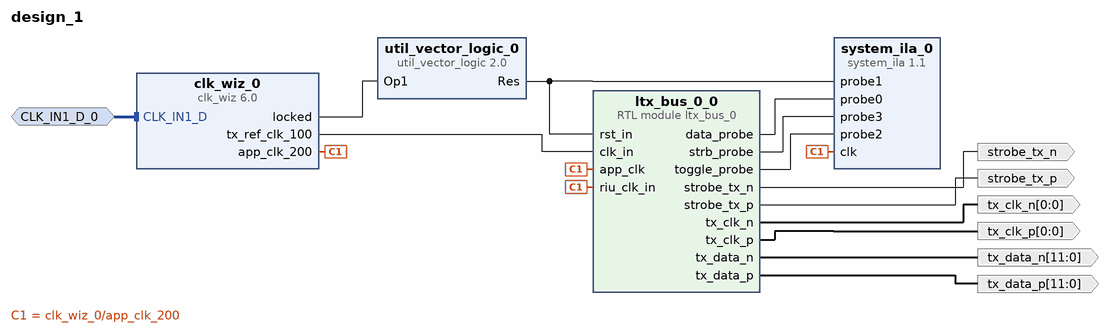
[diagram p0: block diagram of the top level]
# Vivado block design design_1, xcku060-ffva1517-2-e, Vivado 2025.1
create_bd_design design_1

create_bd_intf_port -mode Slave -vlnv xilinx.com:interface:diff_clock_rtl:1.0 CLK_IN1_D_0
set_property -dict {CONFIG.FREQ_HZ 400000000} [get_bd_intf_ports CLK_IN1_D_0]
create_bd_port -dir O -from 0 -to 0 -type clk tx_clk_p
create_bd_port -dir O -from 0 -to 0 -type clk tx_clk_n
create_bd_port -dir O -from 11 -to 0 tx_data_n
create_bd_port -dir O strobe_tx_p
create_bd_port -dir O strobe_tx_n
create_bd_port -dir O -from 11 -to 0 tx_data_p

create_bd_cell -type module -reference ltx_bus_0 ltx_bus_0_0
create_bd_cell -type ip -vlnv xilinx.com:ip:clk_wiz:6.0 clk_wiz_0
set_property -dict [list \
  CONFIG.CLKIN1_JITTER_PS 25.0 \
  CONFIG.CLKOUT1_DRIVES Buffer \
  CONFIG.CLKOUT1_JITTER 100.120 \
  CONFIG.CLKOUT1_PHASE_ERROR 79.885 \
  CONFIG.CLKOUT2_DRIVES Buffer \
  CONFIG.CLKOUT2_JITTER 87.254 \
  CONFIG.CLKOUT2_PHASE_ERROR 79.885 \
  CONFIG.CLKOUT2_REQUESTED_OUT_FREQ 200.000 \
  CONFIG.CLKOUT2_USED true \
  CONFIG.CLKOUT3_DRIVES Buffer \
  CONFIG.CLKOUT4_DRIVES Buffer \
  CONFIG.CLKOUT5_DRIVES Buffer \
  CONFIG.CLKOUT6_DRIVES Buffer \
  CONFIG.CLKOUT7_DRIVES Buffer \
  CONFIG.CLK_OUT1_PORT tx_ref_clk_100 \
  CONFIG.CLK_OUT2_PORT app_clk_200 \
  CONFIG.FEEDBACK_SOURCE FDBK_AUTO \
  CONFIG.MMCM_BANDWIDTH OPTIMIZED \
  CONFIG.MMCM_CLKFBOUT_MULT_F 2.500 \
  CONFIG.MMCM_CLKIN1_PERIOD 2.500 \
  CONFIG.MMCM_CLKIN2_PERIOD 10.0 \
  CONFIG.MMCM_CLKOUT0_DIVIDE_F 10.000 \
  CONFIG.MMCM_CLKOUT1_DIVIDE 5 \
  CONFIG.MMCM_COMPENSATION AUTO \
  CONFIG.NUM_OUT_CLKS 2 \
  CONFIG.OPTIMIZE_CLOCKING_STRUCTURE_EN true \
  CONFIG.PRIMITIVE MMCM \
  CONFIG.PRIM_IN_FREQ 400 \
  CONFIG.PRIM_SOURCE Differential_clock_capable_pin \
] [get_bd_cells clk_wiz_0]
create_bd_cell -type ip -vlnv xilinx.com:ip:util_vector_logic:2.0 util_vector_logic_0
set_property -dict {CONFIG.C_OPERATION not CONFIG.C_SIZE 1} [get_bd_cells util_vector_logic_0]
create_bd_cell -type ip -vlnv xilinx.com:ip:system_ila:1.1 system_ila_0
set_property -dict {CONFIG.C_MON_TYPE NATIVE CONFIG.C_NUM_OF_PROBES 4} [get_bd_cells system_ila_0]

# ---- connections ----

connect_bd_intf_net -intf_net CLK_IN1_D_0_1 [get_bd_intf_ports CLK_IN1_D_0] [get_bd_intf_pins clk_wiz_0/CLK_IN1_D]
connect_bd_net [get_bd_pins clk_wiz_0/app_clk_200] \
  [get_bd_pins system_ila_0/clk] [get_bd_pins ltx_bus_0_0/riu_clk_in] [get_bd_pins ltx_bus_0_0/app_clk]
connect_bd_net [get_bd_pins clk_wiz_0/locked] [get_bd_pins util_vector_logic_0/Op1]
connect_bd_net [get_bd_pins clk_wiz_0/tx_ref_clk_100] [get_bd_pins ltx_bus_0_0/clk_in]
connect_bd_net [get_bd_pins ltx_bus_0_0/data_probe] [get_bd_pins system_ila_0/probe0]
connect_bd_net [get_bd_pins ltx_bus_0_0/strb_probe] [get_bd_pins system_ila_0/probe3]
connect_bd_net [get_bd_pins ltx_bus_0_0/strobe_tx_n] [get_bd_ports strobe_tx_n]
connect_bd_net [get_bd_pins ltx_bus_0_0/strobe_tx_p] [get_bd_ports strobe_tx_p]
connect_bd_net [get_bd_pins ltx_bus_0_0/toggle_probe] [get_bd_pins system_ila_0/probe2]
connect_bd_net [get_bd_pins ltx_bus_0_0/tx_clk_n] [get_bd_ports tx_clk_n]
connect_bd_net [get_bd_pins ltx_bus_0_0/tx_clk_p] [get_bd_ports tx_clk_p]
connect_bd_net [get_bd_pins ltx_bus_0_0/tx_data_n] [get_bd_ports tx_data_n]
connect_bd_net [get_bd_pins ltx_bus_0_0/tx_data_p] [get_bd_ports tx_data_p]
connect_bd_net [get_bd_pins util_vector_logic_0/Res] [get_bd_pins system_ila_0/probe1] [get_bd_pins ltx_bus_0_0/rst_in]

validate_bd_design
save_bd_design
